# Altium project lab2_sokolov_boost.PrjPcb
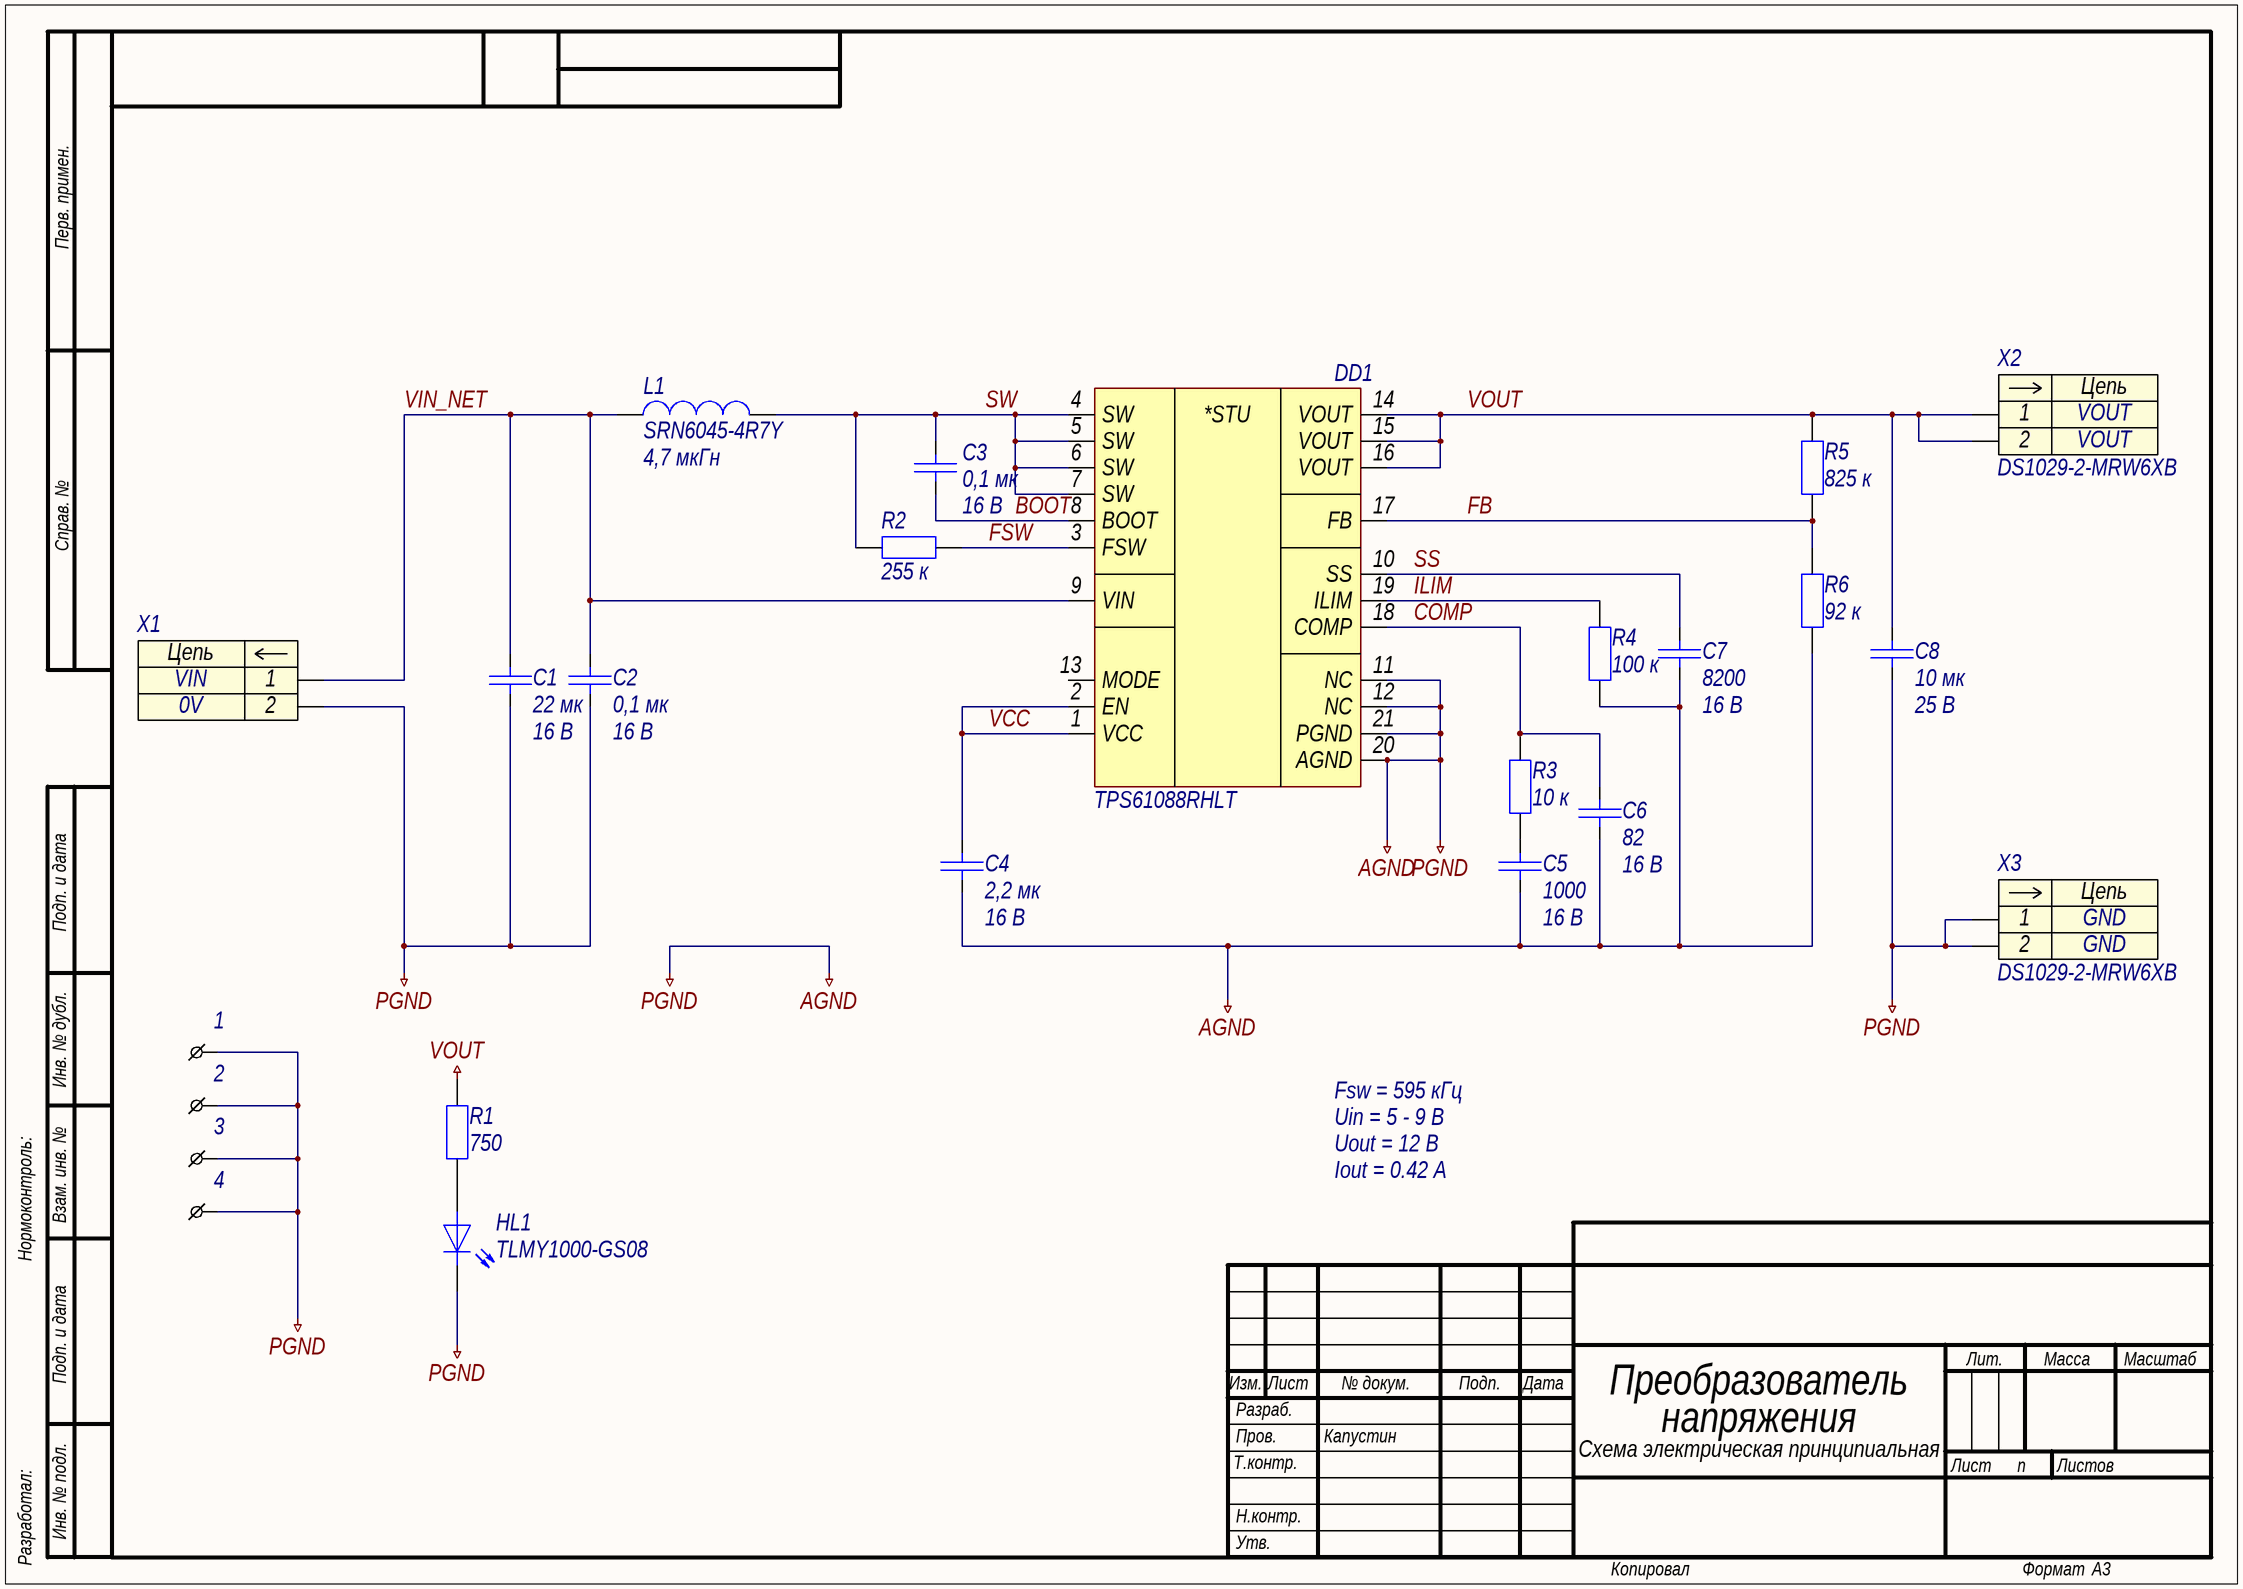
[diagram p0: lab2_sokolov_boost.SchDoc]
approver: Капустин; check: Капустин; designation: СПБПУ.3331506.022; developer: Соколов; document_code: Ý3; document_type: Схема электрическая принципиальная; pcb_dec_number: СПБПУ.3331506.022; project: Лабораторная работа №2; sheets_total: 1; title: Преобразователь напряжения; title_line_1: Преобразователь; title_line_2: напряжения
1 sheet, 24 parts. Net scope: global (net labels, ports and power ports of the same name join across sheets).
Board file: lab2_sokolov_boost.PcbDoc

## Sheet lab2_sokolov_boost.SchDoc: Преобразователь напряжения
size 420 x 297 mm; ApprovedBy: Капустин; CheckedBy: Капустин; DrawnBy: Соколов; DocumentNumber: СПБПУ.3331506.022Ý3; SheetNumber: n; SheetTotal: 1; DocumentCode: Ý3; ImagePath: СПБПУ.3331506.022

### Parts
1  MOUNTING_HOLE  [HOLE_1,6X3,3]  (value not drawn)
2  MOUNTING_HOLE  [HOLE_1,6X3,3]  (value not drawn)
3  MOUNTING_HOLE  [HOLE_1,6X3,3]  (value not drawn)
4  MOUNTING_HOLE  [HOLE_1,6X3,3]  (value not drawn)
C1  22 мк  Напряжение: 16 В  [C1206]
C2  0,1 мк  Напряжение: 16 В  [C0402]
C3  0,1 мк  Напряжение: 16 В  [C0402]
C4  2,2 мк  Напряжение: 16 В  [C0603]
C5  1000  Напряжение: 16 В  [C0201]
C6  82  Напряжение: 16 В  [C0603]
C7  8200  Напряжение: 16 В  [C0402]
C8  10 мк  Напряжение: 25 В  [C0603]
DD1  TPS61088RHLT  [VQFN-20]
HL1  TLMY1000-GS08  [HL0603]
L1  SRN6045-4R7Y  Индуктивность: 4,7 мкГн  [SRN-2-600X600X450]
R1  750  [R0603]
R2  255 к  [R0603]
R3  10 к  [R0603]
R4  100 к  [R0603]
R5  825 к  [R0603]
R6  92 к  [R0402]
X1  (no value)  [DS1029-2-MRW6XB]
X2  DS1029-2-MRW6XB  [DS1029-2-MRW6XB]
X3  DS1029-2-MRW6XB  [DS1029-2-MRW6XB]

### Nets
AGND: 1.1 2.1 3.1 4.1 C1.1 C2.1 C4.1 C5.1 C6.2 C7.1 C8.1 DD1.11(NC) DD1.12(NC) DD1.20(AGND) DD1.21(PGND) HL1.1 R4.2 R6.2 X1.2 X3.1 X3.2  [also labelled PGND]
VOUT: C8.2 DD1.14(VOUT) DD1.15(VOUT) DD1.16(VOUT) R1.1 R5.1 X2.1 X2.2
BOOT: C3.2 DD1.8(BOOT)
COMP: C6.1 DD1.18(COMP) R3.1
FB: DD1.17(FB) R5.2 R6.1
FSW: DD1.3(FSW) R2.2
ILIM: DD1.19(ILIM) R4.1
SS: C7.2 DD1.10(SS)
SW: C3.1 DD1.4(SW) DD1.5(SW) DD1.6(SW) DD1.7(SW) L1.2 R2.1
VCC: C4.2 DD1.1(VCC) DD1.2(EN)
VIN_NET: C1.2 C2.2 DD1.9(VIN) L1.1 X1.1
NetC5_2: C5.2 R3.2
NetHL1_2: HL1.2 R1.2

Not connected (* = marked no-connect by the designer): DD1 13(MODE)

### Notes on the sheet
- Uin = 5 - 9 В
- Fsw = 595 кГц
- Uout = 12 В
- Iout = 0.42 А
- Перв. примен.
- Справ. №
- Подп. и дата
- Инв. № дубл.
- Нормоконтроль:
- Взам. инв. №
- Изм.
- Лист
- № докум.
- Подп.
- Дата
- Лит.
- Масса
- Масштаб
- Т.контр.
- Пров.
- Разраб.
- Листов
- Разработал:
- Инв. № подл.
- Н.контр.
- Утв.
- Копировал
- Формат
- А3
- (in symbol dd0017) *STU
- (in symbol x0007) Цепь

### Library data of the parts
1-4 = fstn0011: Описание: Отверстие под М1,5; Наименование: Отверстие 1,6x3,3; Диаметр отверстия: 1,6 мм; Параметры металлизации: 3,3 мм; id: fstn0011
C1 = c0103: =Описание; ID: c0103; Фамилия: Паньков; Описание: Конденсатор чип 0805 22 мкФ 16 В ±10 %; Наименование: CC1206KRX7R7BB226; Производитель: YAGEO Corp.; Отклонение: ±10 %; Рабочие температуры: от –55 °С до +125 °С; Температурный коэффициент емкости: X7R; Корпус: 1206; Номинал: 22 мк; Номинальное напряжение: 16 В; HelpURL: https://www.yageo.com/upload/media/product/productsearch/datasheet/mlcc/UPY-GPHC_X7R_6.3V-to-50V_20.pdf
C2 C3 = c0028: =Описание; ID: c0028; Фамилия: Паньков; Описание: Конденсатор чип 0402 100 нФ 16 В ±10 %; Наименование: CC0402KRX5R7BB104; Производитель: YAGEO Corp.; Отклонение: ±10 %; Рабочие температуры: от –55 °С до +85 °С; Температурный коэффициент емкости: X5R; Корпус: 0402; Номинал: 0,1 мк; Номинальное напряжение: 16 В; HelpURL: https://www.yageo.com/upload/media/product/productsearch/datasheet/mlcc/UPY-GPHC_X5R_4V-to-50V_26.pdf
C4 = c0069: =Описание; ID: c0069; Фамилия: Паньков; Описание: Конденсатор чип 0603 2,2 мкФ 16 В ±10 %; Наименование: CC0603KRX5R7BB225; Производитель: YAGEO Corp.; Отклонение: ±10 %; Рабочие температуры: от –55 °С до +85 °С; Температурный коэффициент емкости: X5R; Корпус: 0603; Номинал: 2,2 мк; Номинальное напряжение: 16 В; HelpURL: https://www.yageo.com/upload/media/product/productsearch/datasheet/mlcc/UPY-GPHC_X5R_4V-to-50V_26.pdf
C5 = c0119: =Описание; ID: c0119; Фамилия: Соколов; Описание: Конденсатор чип 0201 1000 пФ 16 В ±10 %; Наименование: GRM033R71C102KA01D; Производитель: Murata Electronics; Отклонение: ±10 %; Рабочие температуры: от –55 °С до +125 °С; Температурный коэффициент емкости: X7R; Корпус: 0201; Номинал: 1000; Номинальное напряжение: 16 В; HelpURL: https://datasheet.octopart.com/GRM033R71C102KA01D-Murata-datasheet-14399077.pdf
C6 = c0011: =Описание; ID: c0011; Фамилия: Ларионов; Описание: Конденсатор чип 0603 82 пФ 16 В ±5 %; Наименование: CC0603JRNPO7BN820; Производитель: YAGEO Corp.; Отклонение: ±5 %; Рабочие температуры: от –55 °С до +125 °С; Температурный коэффициент емкости: C0G; Корпус: 0603; Номинал: 82; Номинальное напряжение: 16 В; HelpURL: https://www.yageo.com/upload/media/product/productsearch/datasheet/mlcc/UPY-GP_NP0_16V-to-50V_18.pdf
C7 = c0120: =Описание; ID: c0120; Фамилия: Соколов; Описание: Конденсатор чип 0402 8,2 нФ 50 В ±5 %; Наименование: GRM155R71C822KA01D; Производитель: Murata Electronics; Отклонение: ±5 %; Рабочие температуры: от –55 °С до +125 °С; Температурный коэффициент емкости: C0G; Корпус: 0402; Номинал: 8200; Номинальное напряжение: 16 В; HelpURL: https://ru.mouser.com/datasheet/2/281/murata_03052018_GRM_Series_1-1310166.pdf
C8 = c0090: =Описание; ID: c0090; Фамилия: Паньков; Описание: Конденсатор чип 0603 10 мкФ 25 В ±10 %; Наименование: CC0603KRX5R8BB106; Производитель: YAGEO Corp.; Отклонение: ±10 %; Рабочие температуры: от –55 °С до +85 °С; Температурный коэффициент емкости: X5R; Корпус: 0603; Номинал: 10 мк; Номинальное напряжение: 25 В; HelpURL: https://www.yageo.com/upload/media/product/productsearch/datasheet/mlcc/UPY-GPHC_X5R_4V-to-50V_26.pdf
DD1 = dd0017: =Описание; ID: dd0017; Фамилия: Соколов; Описание: Повышающий преобразователь напряжения 12,6 В и 11,9 А; Производитель: Texas Instruments; Входное напряжение: от 2,7 В до 12 В; Выходное напряжение: от 4,5 В до 12,6 В; Коммутируемый ток: до 11,9 А; Частота переключения: от 200 кГц до 2,2 МГц; Рабочие температуры: от -40 °С до +85 °С; Наименование: TPS61088RHLT; Корпус: VQFN-20; HelpURL: https://www.ti.com/product/TPS61088
HL1 = hl0003: =Описание; ID: hl0003; Фамилия: Ларионов; Описание: Светодиод чип 0603 желтый; Производитель: Vishay Intertechnology, Inc.; Цвет: Yellow; Номинальная сила света: 7,5 мкд; Номинальная длина волны: 588 нм; Номинальный прямой ток: 15 мА; Номинальное падение напряжения: 1,8 В; Рассеиваемая мощность: 40 мВт; Рабочие температуры: от -40 °С до +100 °С; Корпус: 0603; Наименование: TLMY1000-GS08; HelpURL: https://www.vishay.com/leds/list/product-83172/
L1 = l0006: =Описание; ID: l0006; Фамилия: Соколов; Описание: Катушка индуктивности 4,7 мкГн ±30 %; Производитель: Bourns, Inc.; Отклонение: ±30 %; Номинальное активное сопротивление: 37,6 мОм; Резонансная частота: 7,96 МГц; Номинальный ток (при нагреве на 20 °С/40 °С): 3 А; Ток насыщения: 3,5 А; Рабочее напряжение: не указано; Рабочие температуры: от –40 °С до +125 °С; Корпус: 6,0 x 6,0 x 4,5; Наименование: SRN6045-4R7Y; Номинал: 4,7 мкГн; Максимальное активное сопротивление: 37,6 мОм; HelpURL: https://www.bourns.com/products/magnetic-products/power-inductors-smd-semi-shielded/product/SRN6045
R1 = r0028: =Описание; ID: r0028; Фамилия: Паньков; Описание: Резистор чип 0603 750 Ом ±1 % 0,1 Вт; Наименование: RC0603FR-07750RL; Производитель: YAGEO Corp.; Отклонение: ±1 %; Номинальное напряжение: 75 В; Рабочие температуры: от –55 °С до +155 °С; Номинальный ток: 1 А; Корпус: 0603; Номинал: 750; HelpURL: https://www.yageo.com/upload/media/product/productsearch/datasheet/rchip/PYu-RC_Group_51_RoHS_L_11.pdf
R2 = r0109: =Описание; ID: r0109; Фамилия: Ляпцев; Описание: Резистор чип 0603 255 кОм ±1 % 0,1 Вт; Наименование: RC0603FR-07255KL; Производитель: YAGEO Corp.; Отклонение: ±1 %; Номинальное напряжение: 75 В; Рабочие температуры: от –55 °С до +155 °С; Номинальный ток: 1 А; Корпус: 0603; Номинал: 255 к; HelpURL: https://www.yageo.com/upload/media/product/productsearch/datasheet/rchip/PYu-RC_Group_51_RoHS_L_11.pdf
R3 = r0017: =Описание; ID: r0017; Фамилия: Самарин; Описание: Резистор чип 0603 10 кОм ±1 % 0,1 Вт; Наименование: RC0603FR-0710KL; Производитель: YAGEO Corp.; Отклонение: ±1 %; Номинальное напряжение: 75 В; Рабочие температуры: от -55 °С до +155 °С; Номинальный ток: 1 А; Корпус: 0603; Номинал: 10 к; HelpURL: https://www.yageo.com/upload/media/product/productsearch/datasheet/rchip/PYu-RC_Group_51_RoHS_L_11.pdf
R4 = r0094: =Описание; ID: r0094; Фамилия: Водорезов; Описание: Резистор чип 0603 100 кОм ±1 % 0,1 Вт; Наименование: RC0603FR-07100KL; Производитель: YAGEO Corp.; Отклонение: ±1 %; Номинальное напряжение: 75 В; Рабочие температуры: от –55 °С до +155 °С; Номинальный ток: 1 А; Корпус: 0603; Номинал: 100 к; HelpURL: https://www.yageo.com/upload/media/product/productsearch/datasheet/rchip/PYu-RC_Group_51_RoHS_L_11.pdf
R5 = r0134: =Описание; ID: r0134; Фамилия: Соколов; Описание: Резистор чип 0603 825 кОм ±1 % 0,1 Вт; Наименование: RC0603FR-07825KL; Производитель: YAGEO Corp.; Отклонение: ±1 %; Номинальное напряжение: 75 В; Рабочие температуры: от –55 °С до +155 °С; Номинальный ток: 1 А; Корпус: 0603; Номинал: 825 к; HelpURL: https://www.yageo.com/upload/media/product/productsearch/datasheet/rchip/PYu-RC_Group_51_RoHS_L_11.pdf
R6 = r0132: =Описание; ID: r0132; Фамилия: Соколов; Описание: Резистор чип 0402 92 кОм ±1 % 0,1 Вт; Наименование: RT0805BRD0792KL; Производитель: Yageo; Отклонение: ±1 %; Номинальное напряжение: 75 В; Рабочие температуры: от -55 °С до +155 °С; Номинальный ток: 1 А; Корпус: 0402; Номинал: 92 к; HelpURL: https://ru.mouser.com/datasheet/2/447/PYu-RT_1-to-0.01_RoHS_L_11-1669912.pdf
X1 = x0007: =Описание; Contact_1: VIN; Contact_2: 0V; ID: x0007; Фамилия: Ларионов; Описание: CWF 2 pin Type B 2,5 мм вилка угловой; Производитель: Connfly Electronic Co. LTD.; Наименование: DS1029-2-MRW6XB; HelpURL: http://www.connfly.com/productshow.aspx?id=352
X2 = x0007: =Описание; Contact_1: VOUT; ID: x0007; Фамилия: Ларионов; Описание: CWF 2 pin Type B 2,5 мм вилка угловой; Производитель: Connfly Electronic Co. LTD.; Contact_2: VOUT; Наименование: DS1029-2-MRW6XB; HelpURL: http://www.connfly.com/productshow.aspx?id=352
X3 = x0007: =Описание; Contact_1: GND; ID: x0007; Фамилия: Ларионов; Описание: CWF 2 pin Type B 2,5 мм вилка угловой; Производитель: Connfly Electronic Co. LTD.; Contact_2: GND; Наименование: DS1029-2-MRW6XB; HelpURL: http://www.connfly.com/productshow.aspx?id=352